# Altium schematic sheet 08-TYPE-C-PORT.SchDoc
size A4; DocumentNumber: 8; SheetNumber: 8; SheetTotal: 8
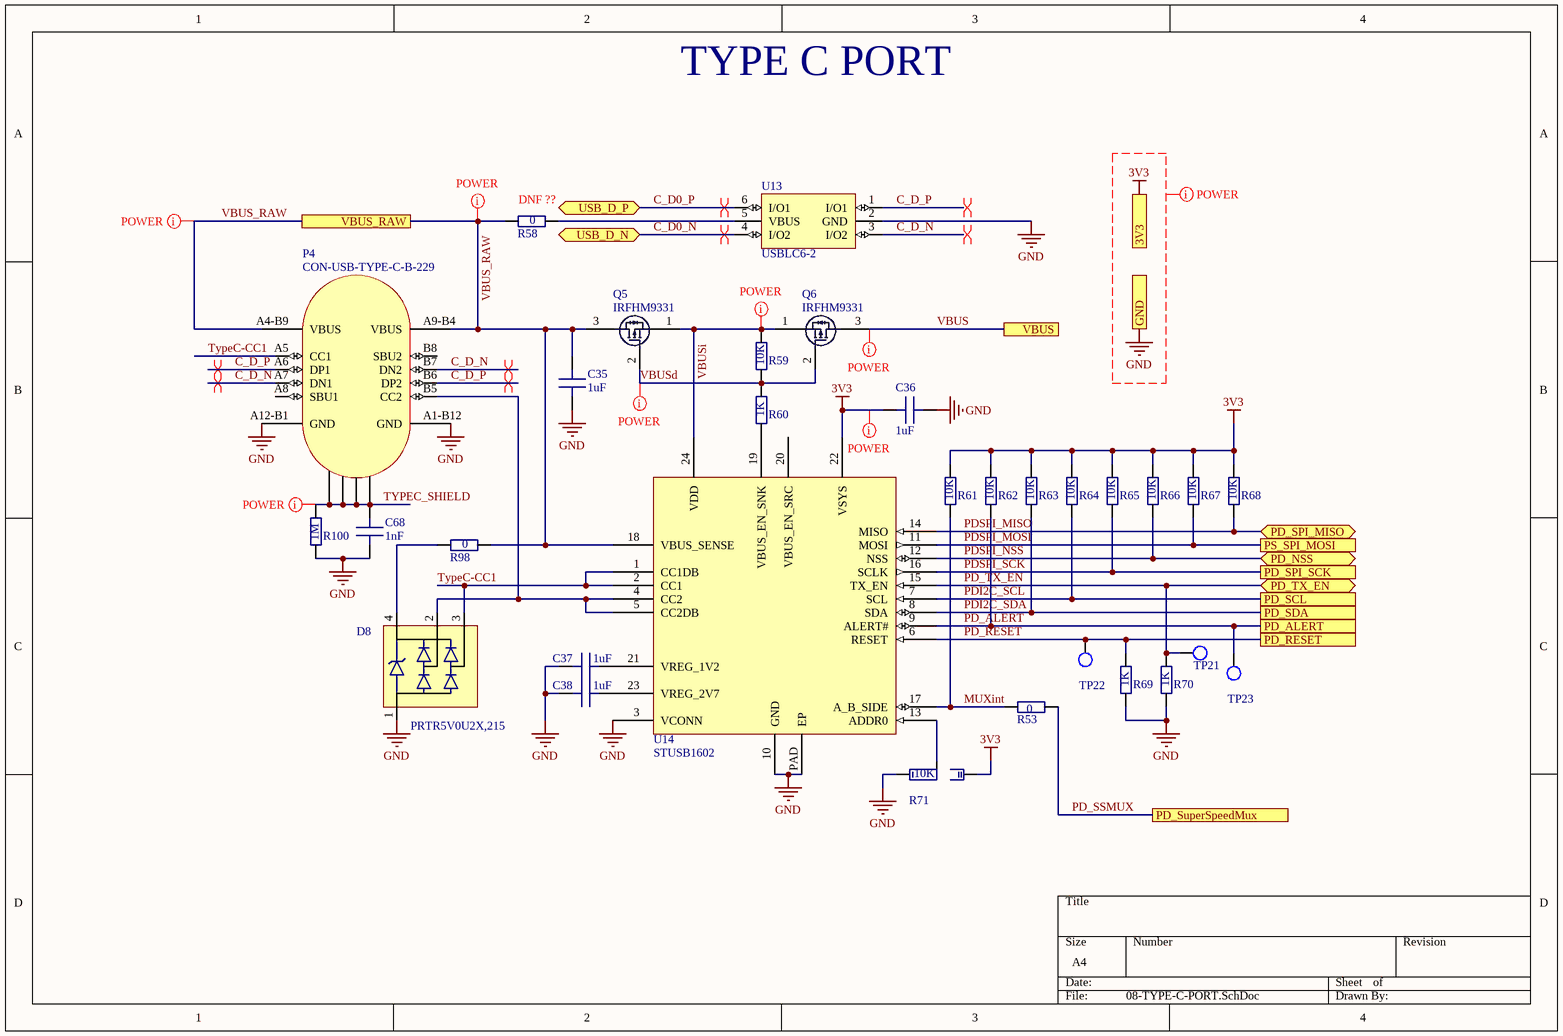
[diagram p0: 08-TYPE-C-PORT.SchDoc]

## Parts
C35  1uF  [C0805]
C36  1uF  [C0805]
C37  1uF  [C0805]
C38  1uF  [C0805]
C68  1nF  [C1206]
D8  PRTR5V0U2X,215  [SOT143B]
P4  CON-USB-TYPE-C-B-229  [USB-Type-C-B-229]
Q5  IRFHM9331  [PQFN-3x3]
Q6  IRFHM9331  [PQFN-3x3]
R53  Resistance: 0  [R0402]
R58  Resistance: 0  [R0402_NOSILK]
R59  Resistance: 10K  [R0603]
R60  Resistance: 1K  [R0603]
R61  Resistance: 10K  [R0603]
R62  Resistance: 10K  [R0603]
R63  Resistance: 10K  [R0603]
R64  Resistance: 10K  [R0603]
R65  Resistance: 10K  [R0603]
R66  Resistance: 10K  [R0603]
R67  Resistance: 10K  [R0603]
R68  Resistance: 10K  [R0603]
R69  Resistance: 1K  [R0603]
R70  Resistance: 1K  [R0603]
R71  Resistance: 10K  [RJ0603]
R98  Resistance: 0  [R0402]
R100  Resistance: 1M  [R2512]
TP21  TEST_POINT  [TP_1mm]  (value not drawn)
TP22  TEST_POINT  [TP_1mm]  (value not drawn)
TP23  TEST_POINT  [TP_1mm]  (value not drawn)
U13  USBLC6-2  [SOT-666]
U14  STUSB1602  [QFN24-4x4x0.9]

## Ports
3V3, GND, PD_ALERT, PD_NSS (bidir), PD_RESET, PD_SCL, PD_SDA, PD_SPI_MISO (bidir), PD_SPI_SCK, PD_SuperSpeedMux, PD_TX_EN (bidir), PS_SPI_MOSI, USB_D_N (bidir), USB_D_P (bidir), VBUS, VBUS_RAW

## Nets
3V3: C36.1 R61.2 R62.2 R63.2 R64.2 R65.2 R66.2 R67.2 R68.2 R71.3 U14.22(VSYS) ; port 3V3
GND: C35.1 C36.2 C37.1 C38.1 C68.1 D8.1(P$1) P4.A1-B12(GND) P4.A12-B1(GND) R69.1 R70.1 R71.1 R100.1 U13.2(GND) U14.3(VCONN) U14.10(GND) U14.PAD(EP) ; port GND
C_D0_N: U13.4(I/O2) ; port USB_D_N
C_D0_P: U13.6(I/O1) ; port USB_D_P
C_D_N: P4.A7(DN1) P4.B7(DN2) U13.3(I/O2)
C_D_P: P4.A6(DP1) P4.B6(DP2) U13.1(I/O1)
MUXint: R53.2 R61.1 U14.17(A_B_SIDE)
PD_ALERT: R62.1 TP23.1 U14.9(ALERT#) ; port PD_ALERT
PD_RESET: R69.2 TP22.1 U14.6(RESET) ; port PD_RESET
PD_SSMUX: R53.1 ; port PD_SuperSpeedMux
PD_TX_EN: R70.2 TP21.1 U14.15(TX_EN) ; port PD_TX_EN
PDI2C_SCL: R64.1 U14.7(SCL) ; port PD_SCL
PDI2C_SDA: R63.1 U14.8(SDA) ; port PD_SDA
PDSPI_MISO: R68.1 U14.14(MISO) ; port PD_SPI_MISO
PDSPI_MOSI: R67.1 U14.11(MOSI) ; port PS_SPI_MOSI
PDSPI_NSS: R66.1 U14.12(NSS) ; port PD_NSS
PDSPI_SCK: R65.1 U14.16(SCLK) ; port PD_SPI_SCK
TypeC-CC1: D8.3(P$3) P4.A5(CC1) U14.1(CC1DB) U14.2(CC1)
TYPEC_SHIELD: C68.2 P4.SHIELD R100.2
VBUS: Q6.3(D) ; port VBUS
VBUS_RAW: C35.2 P4.A4-B9(VBUS) P4.A9-B4(VBUS) Q5.3(D) R58.1 R98.2 U14.18(VBUS_SENSE) ; port VBUS_RAW
VBUSd: Q5.2(G) Q6.2(G) R59.1 R60.2
VBUSi: Q5.1(S) Q6.1(S) R59.2 U14.24(VDD)
NetC37_2: C37.2 U14.21(VREG_1V2)
NetC38_2: C38.2 U14.23(VREG_2V7)
NetD8_2: D8.2(P$2) P4.B5(CC2) U14.4(CC2) U14.5(CC2DB)
NetD8_4: D8.4(P$4) R98.1
NetR58_2: R58.2 U13.5(VBUS)
NetR60_1: R60.1 U14.19(VBUS_EN_SNK)
NetR71_2: R71.2 U14.13(ADDR0)

Not connected (* = marked no-connect by the designer): P4 A8(SBU1) B8(SBU2); U14 20(VBUS_EN_SRC)

## Layout directives
differential pair; net class USB: C_D0_N, C_D0_P, C_D_N, C_D_P
net class POWER_NET_CLASS: 3V3, GND, TYPEC_SHIELD, VBUS, VBUS_RAW, VBUSd, VBUSi

## Notes on the sheet
- TYPE C PORT
- (near R58) DNF ??

## Library data of the parts
C35-C38 = C0805_1uF_25V: Ceramic capacitor; Voltage: 25V; Capacity: 1uF; Size: 0805; Value: 1uF
C68 = C1206_1nF_2KV: Ceramic capacitor; Voltage: 2KV; Capacity: 1nF; Size: 1206; Value: 1nF
D8 = PRTR5V0U2X,215: PRTR5V0U2X - Ultra low capacitance double rail-to-rail ESD protection diode; MF: Nexperia USA; Package: SOT-143 Nexperia; Price: None; Availability: Unavailable; MP: PRTR5V0U2X,215; SnapEDA_Link: https://www.snapeda.com/parts/PRTR5V0U2X%2C215/Nexperia%20USA%20Inc./view-part/?ref=snap; Value: *
R53 R58 R98 = R0402_0R: Resistor General; Tolerance: *; Size: 0402
R59 = R0603_10K_1%: Resistor General; Tolerance: 1%; Size: 0603
R60 = R0603_1K_1%: Resistor General; Tolerance: 1%; Size: 0603
R61-R68 = R0603_10K: Resistor General; Tolerance: 5%; Size: 0603
R69 R70 = R0603_1K: Resistor General; Tolerance: 5%; Size: 0603
R71 = RJ0603_10K: Resistor General; Tolerance: 5%; Size: 0603
R100 = R2512_1M_5%: Resistor General; Tolerance: 5%; Size: 2512
U13 = USBLC6-2: Very low capacitance ESD protection
U14 = STUSB1602: USB Type-C controller with TX/RX line driver and BMC